# Altium project LaserMet Shutter Control.PrjPcb
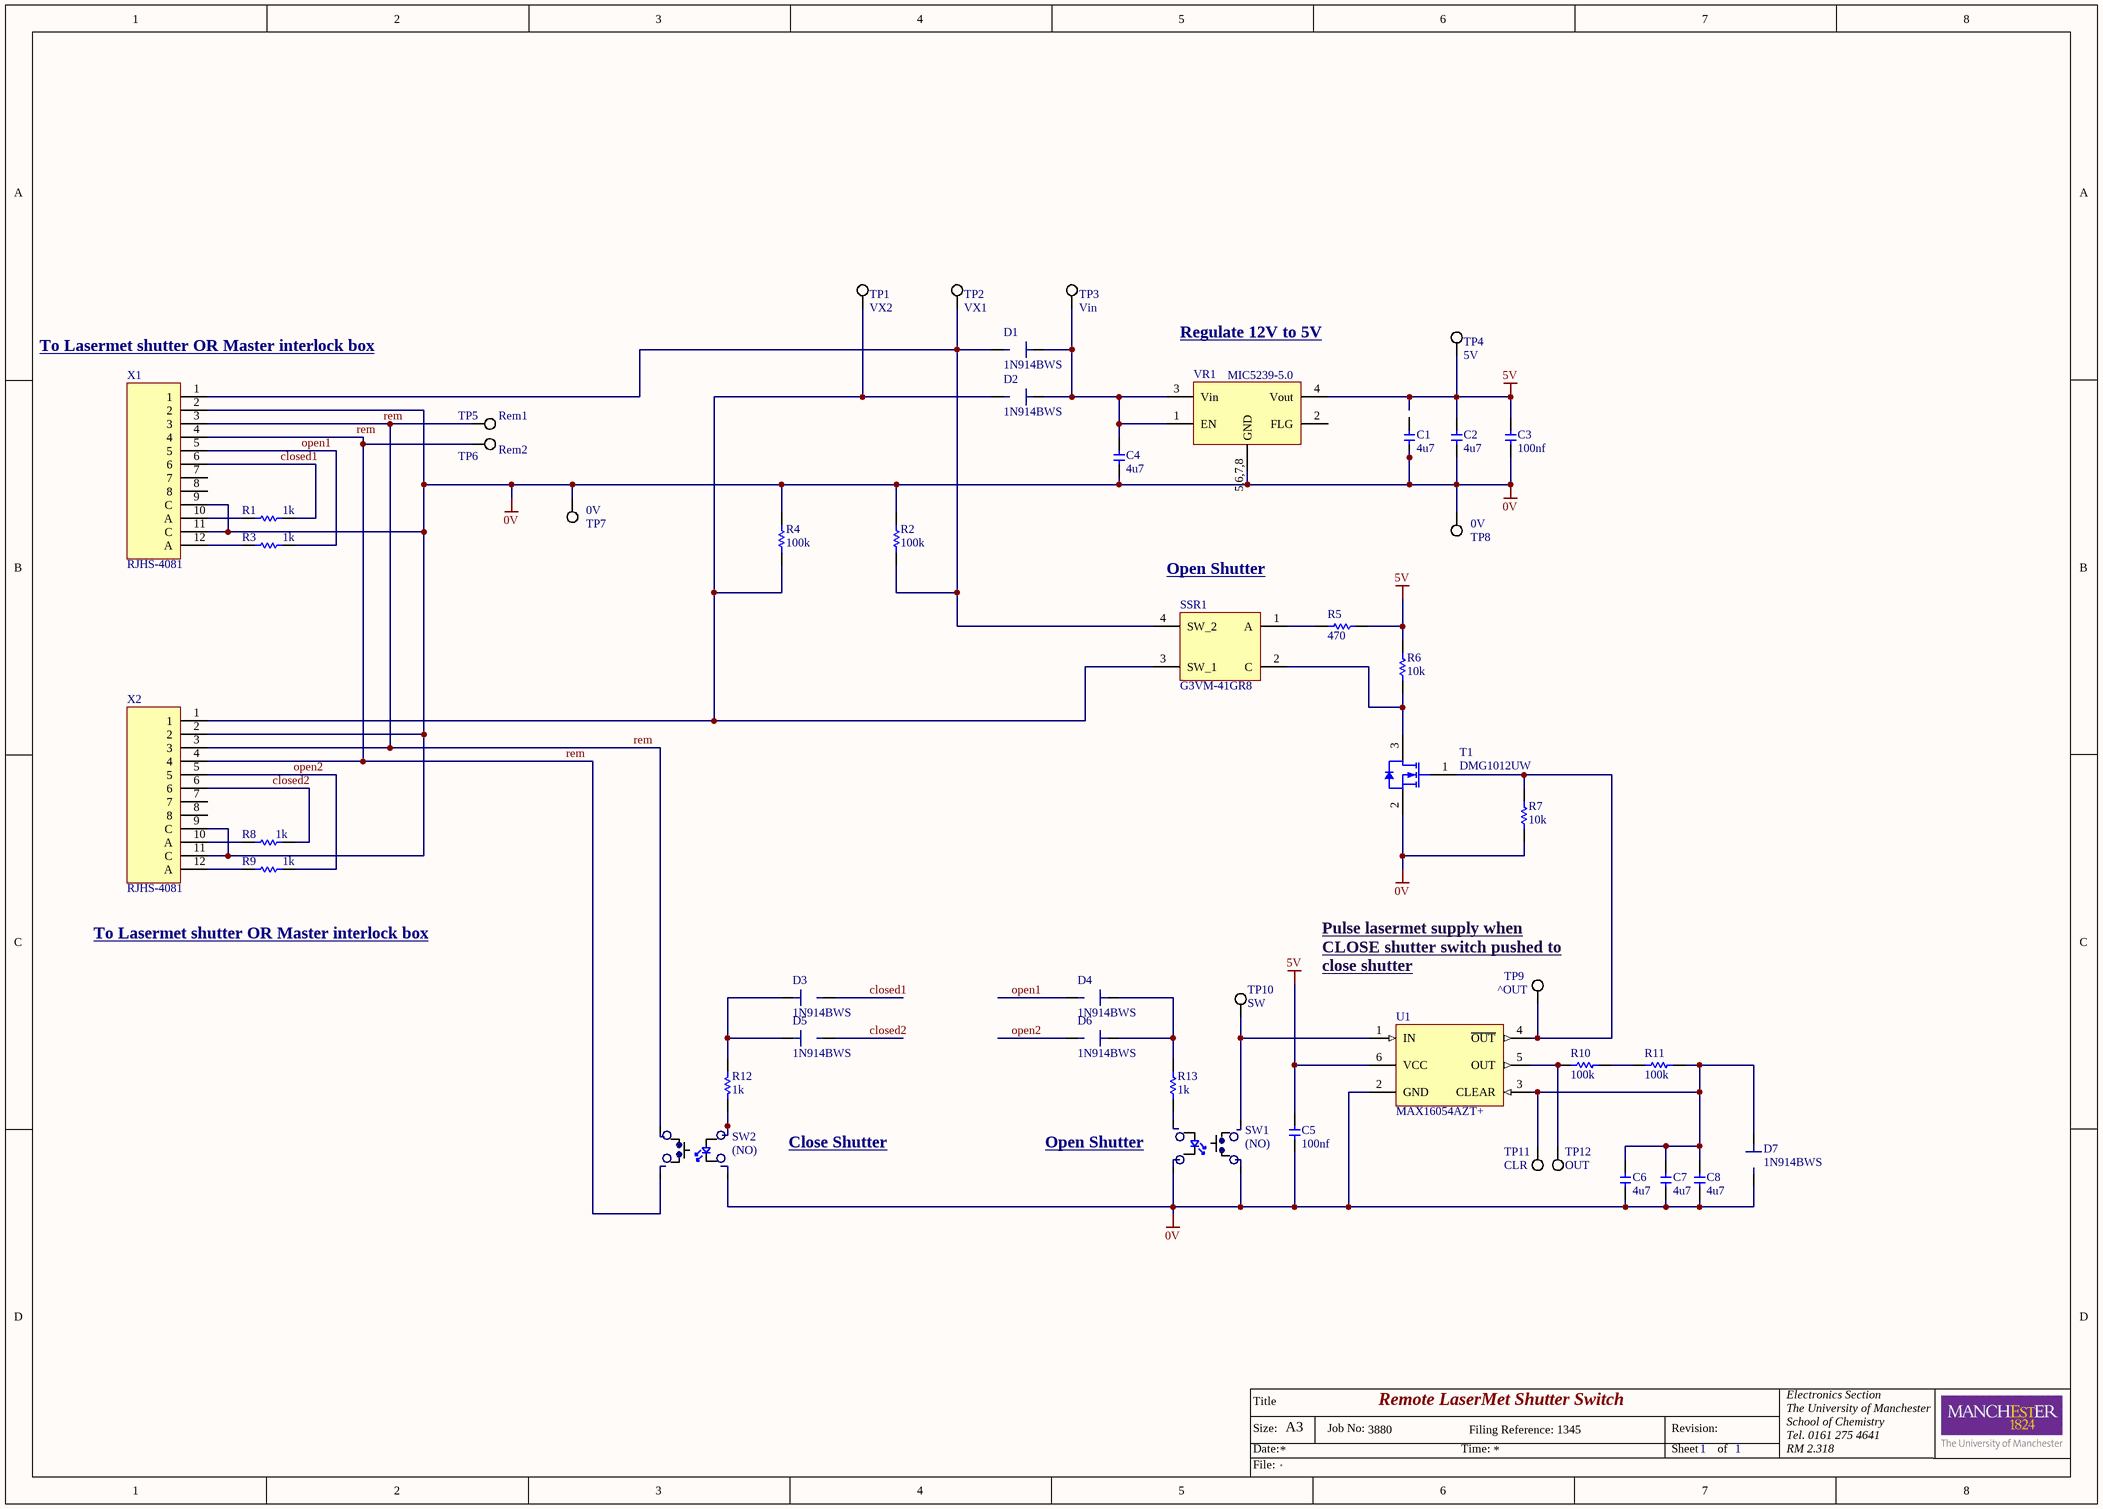
[diagram p0: Main.SchDoc]
1 sheet, 48 parts. Net scope: global (net labels, ports and power ports of the same name join across sheets).
Board file: shutter switch.PcbDoc

## Sheet Main.SchDoc: Remote LaserMet Shutter Switch
size A3; Organization: Electronics Section; Address1: The University of Manchester; Address2: School of Chemistry; Address3: Tel. 0161 275 4641; Address4: RM 2.318; SheetNumber: 1; SheetTotal: 1; FR: 1345; JobNo: 3880

### Parts
C1  4u7  [Murata_Chip2PinSM127P600-8N]
C2  4u7  [Murata_Chip2PinSM127P600-8N]
C3  100nf  [Multicomp capacitor 0805 Chip2PinSM127P600-8N]
C4  4u7  [Murata_Chip2PinSM127P600-8N]
C5  100nf  [Multicomp capacitor 0805 Chip2PinSM127P600-8N]
C6  4u7  [Murata_Chip2PinSM127P600-8N]
C7  4u7  [Murata_Chip2PinSM127P600-8N]
C8  4u7  [Murata_Chip2PinSM127P600-8N]
D1  1N914BWS  [1N914BWS]
D2  1N914BWS  [1N914BWS]
D3  1N914BWS  [1N914BWS]
D4  1N914BWS  [1N914BWS]
D5  1N914BWS  [1N914BWS]
D6  1N914BWS  [1N914BWS]
D7  1N914BWS  [1N914BWS]
R1  1k  [Multicomp 0805 Chip2PinSM127P600-8N]
R2  100k  [Multicomp 0805 Chip2PinSM127P600-8N]
R3  1k  [Multicomp 0805 Chip2PinSM127P600-8N]
R4  100k  [Multicomp 0805 Chip2PinSM127P600-8N]
R5  470  [Resistor 0805 YAGEO CAPC2012X06N]
R6  10k  [Multicomp 0805 Chip2PinSM127P600-8N]
R7  10k  [Multicomp 0805 Chip2PinSM127P600-8N]
R8  1k  [Multicomp 0805 Chip2PinSM127P600-8N]
R9  1k  [Multicomp 0805 Chip2PinSM127P600-8N]
R10  100k  [Multicomp 0805 Chip2PinSM127P600-8N]
R11  100k  [Multicomp 0805 Chip2PinSM127P600-8N]
R12  1k  [Multicomp 0805 Chip2PinSM127P600-8N]
R13  1k  [Multicomp 0805 Chip2PinSM127P600-8N]
SSR1  G3VM-41GR8  [G3VM-41GR8]
SW1  (NO)  [MCPA switch]
SW2  (NO)  [MCPA switch]
T1  DMG1012UW  [SOT65P255X100-3N]
TP1  VX2  [S2751-46R]
TP2  VX1  [S2751-46R]
TP3  Vin  [S2751-46R]
TP4  5V  [S2751-46R]
TP5  Rem1  [S2751-46R]
TP6  Rem2  [S2751-46R]
TP7  0V  [S2751-46R]
TP8  0V  [S2751-46R]
TP9  ^OUT  [S2751-46R]
TP10  SW  [S2751-46R]
TP11  CLR  [S2751-46R]
TP12  OUT  [S2751-46R]
U1  MAX16054AZT+  [Z6+1_L]
VR1  MIC5239-5.0  [SOIC127P600X173-8N]
X1  RJHS-4081  [RJHS-4081]
X2  RJHS-4081  [RJHS-4081]

### Nets
0V: C1.2 C2.2 C3.2 C4.2 C5.1 C6.2 C7.2 C8.2 D7.2 R2.2 R4.2 R7.1 SW1.1 SW1.4(-) SW2.4(-) T1.2(S) TP7.1 TP8.1 U1.2(GND) VR1.5,6,7,8(GND) X1.2 X1.9(C) X1.11(C) X2.2 X2.9(C) X2.11(C)
5V: C2.1 C3.1 C5.2 R5.2 R6.2 TP4.1 U1.6(VCC) VR1.4(Vout)
closed1: D3.2 R1.2 X1.6
closed2: D5.2 R8.2 X2.6
open1: D4.2 R3.2 X1.5
open2: D6.2 R9.2 X2.5
rem: SW2.1 SW2.2 TP5.1 TP6.1 X1.3 X1.4 X2.3 X2.4
NetC4_1: C4.1 D1.1 D2.1 TP3.1 VR1.1(EN) VR1.3(Vin)
NetC6_1: C6.1 C7.1 C8.1 D7.1 R11.1 TP11.1 U1.3(CLEAR)
NetD1_2: D1.2 R2.1 SSR1.4(SW_2) TP2.1 X1.1
NetD2_2: D2.2 R4.1 SSR1.3(SW_1) TP1.1 X2.1
NetD3_1: D3.1 D5.1 R12.2
NetD4_1: D4.1 D6.1 R13.2
NetR1_1: R1.1 X1.10(A)
NetR3_1: R3.1 X1.12(A)
NetR5_1: R5.1 SSR1.1(A)
NetR6_1: R6.1 SSR1.2(C) T1.3(D)
NetR7_2: R7.2 T1.1(G) TP9.1 U1.4(~{OUT})
NetR8_1: R8.1 X2.10(A)
NetR9_1: R9.1 X2.12(A)
NetR10_1: R10.1 R11.2
NetR10_2: R10.2 TP12.1 U1.5(OUT)
NetR12_1: R12.1 SW2.3(+)
NetR13_1: R13.1 SW1.3(+)
NetSW1_2: SW1.2 TP10.1 U1.1(IN)

Not connected (* = marked no-connect by the designer): C1 1; VR1 2(FLG); X1 7 8; X2 7 8

### Notes on the sheet
- (near X1) To Lasermet shutter OR Master interlock box
- Regulate 12V to 5V
- (near SSR1) Open Shutter
- To Lasermet shutter OR Master interlock box
- (near TP9) Pulse lasermet supply when CLOSE shutter switch pushed to close shutter
- Close Shutter
- (near SW1) Open Shutter
- Title
- Size:
- Date:
- A3
- Job No:
- Time:
- Filing Reference:
- Revision:
- Sheet
- of
- File:

### Library data of the parts
C1 C2 C4 C6-C8 = 4.7U 0805: Supplier 1: Farnell; Supplier Part Number 1: 2611942
C3 C5 = 100nf 0805: Supplier 1: Farnell; Supplier Part Number 1: 1759265RL
R1 R3 R8 R9 R12 R13 = 1k OHM Resistor 0805: Resistor 0805 Multicomp STOCKED; Supplier Part Number 1: 2447587; Supplier 1: Farnell
R2 R4 R10 R11 = 100k OHM Resistor 0805: 100k 0805 MCWR series; Supplier 1: Farnell; Supplier Part Number 1: 2446868
R5 = 470 OHM Resistor 0805: Resistor 0805 YAGEO RC Series STOCKED; Supplier 1: Farnell; Supplier Part Number 1: 9233962
R6 R7 = 10k OHM Resistor 0805: Resistor 0805 Multicomp MCWR08 Series STOCKED; Supplier 1: Farnell; Supplier Part Number 1: 2447553
SSR1 = SSR_G3VM-41GR8: opto isolated SSR bidirectional mosfet relay; Supplier 1: Farnell; Supplier Part Number 1: 2065749
SW1 SW2 = MCPAS6-B2-M1CES2-5L6: push button  (no) 50v 125ma; Supplier 1: Farnell; Supplier 2: Newark; Supplier 3: Element14; Supplier Part Number 1: 2146911; Supplier Part Number 2: 28W1907; Supplier Part Number 3: 2146911
T1 = DMG1012UW-7: mosfet N chan enhancement-vds max 20v-id=1a; Supplier 1: Digi-Key; Supplier 2: Mouser; Supplier 3: RSComponents; Supplier Part Number 1: DMG1012UW-7DIDKR-ND; Supplier Part Number 2: 621-DMG1012UW-7; Supplier Part Number 3: 751-4073
TP1-TP12 = S2751-46R: Medium SMD Micro Test Point; Supplier 1: Digi-Key; Supplier 2: Newark; Supplier 3: Mouser; Supplier Part Number 1: 952-2664-6-ND; Supplier Part Number 2: 76Y5390; Supplier Part Number 3: 855-S2751-46R
U1 = CMP-0251-00628-1: On/Off Controller with Debounce and +/-15kV ESD Protection, 6-Pin SOT, -40°C to +125°C, Pb-Free; ComponentLink3Description: Package Specification; PackageReference: z6+1; DatasheetVersion: Rev 0, May-2008; Code_JEITA: SC-74; ComponentLink2Description: Datasheet; ComponentLink1Description: Manufacturer URL; ComponentLink2URL: http://datasheets.maxim-ic.com/en/ds/MAX16054.pdf; PackageVersion: revD, 2011; ComponentLink1URL: http://www.maxim-ic.com; ComponentLink3URL: http://pdfserv.maxim-ic.com/package_dwgs/21-0114.PDF; PackageDescription: 6-Pin Thin Small-Outline Transistor, 2.9 x 1.6 mm Body, 0.95 mm Pitch, 2.8 mm Lead Span, SOT-23, Pb-Free; Code_JEDEC: MO-193*
VR1 = MIC5239-5.0YS: 5v 500ma voltage regulator with enable and FLAG; Supplier 1: Farnell; Supplier 2: RSComponents; Supplier Part Number 1: 2510293; Supplier Part Number 2: 1770462
X1 X2 = RJ45_RJHS-4081: Amphenol Female RJ45 Connector Right Angle Through Hole; Supplier 1: RSComponents; Supplier Part Number 1: 257-8779
D1-D7 = 1N914BWS: Supplier 1: Farnell; Supplier Part Number 1: 2453274